# EAGLE schematic Summer Board (EAGLE 9.6.2)
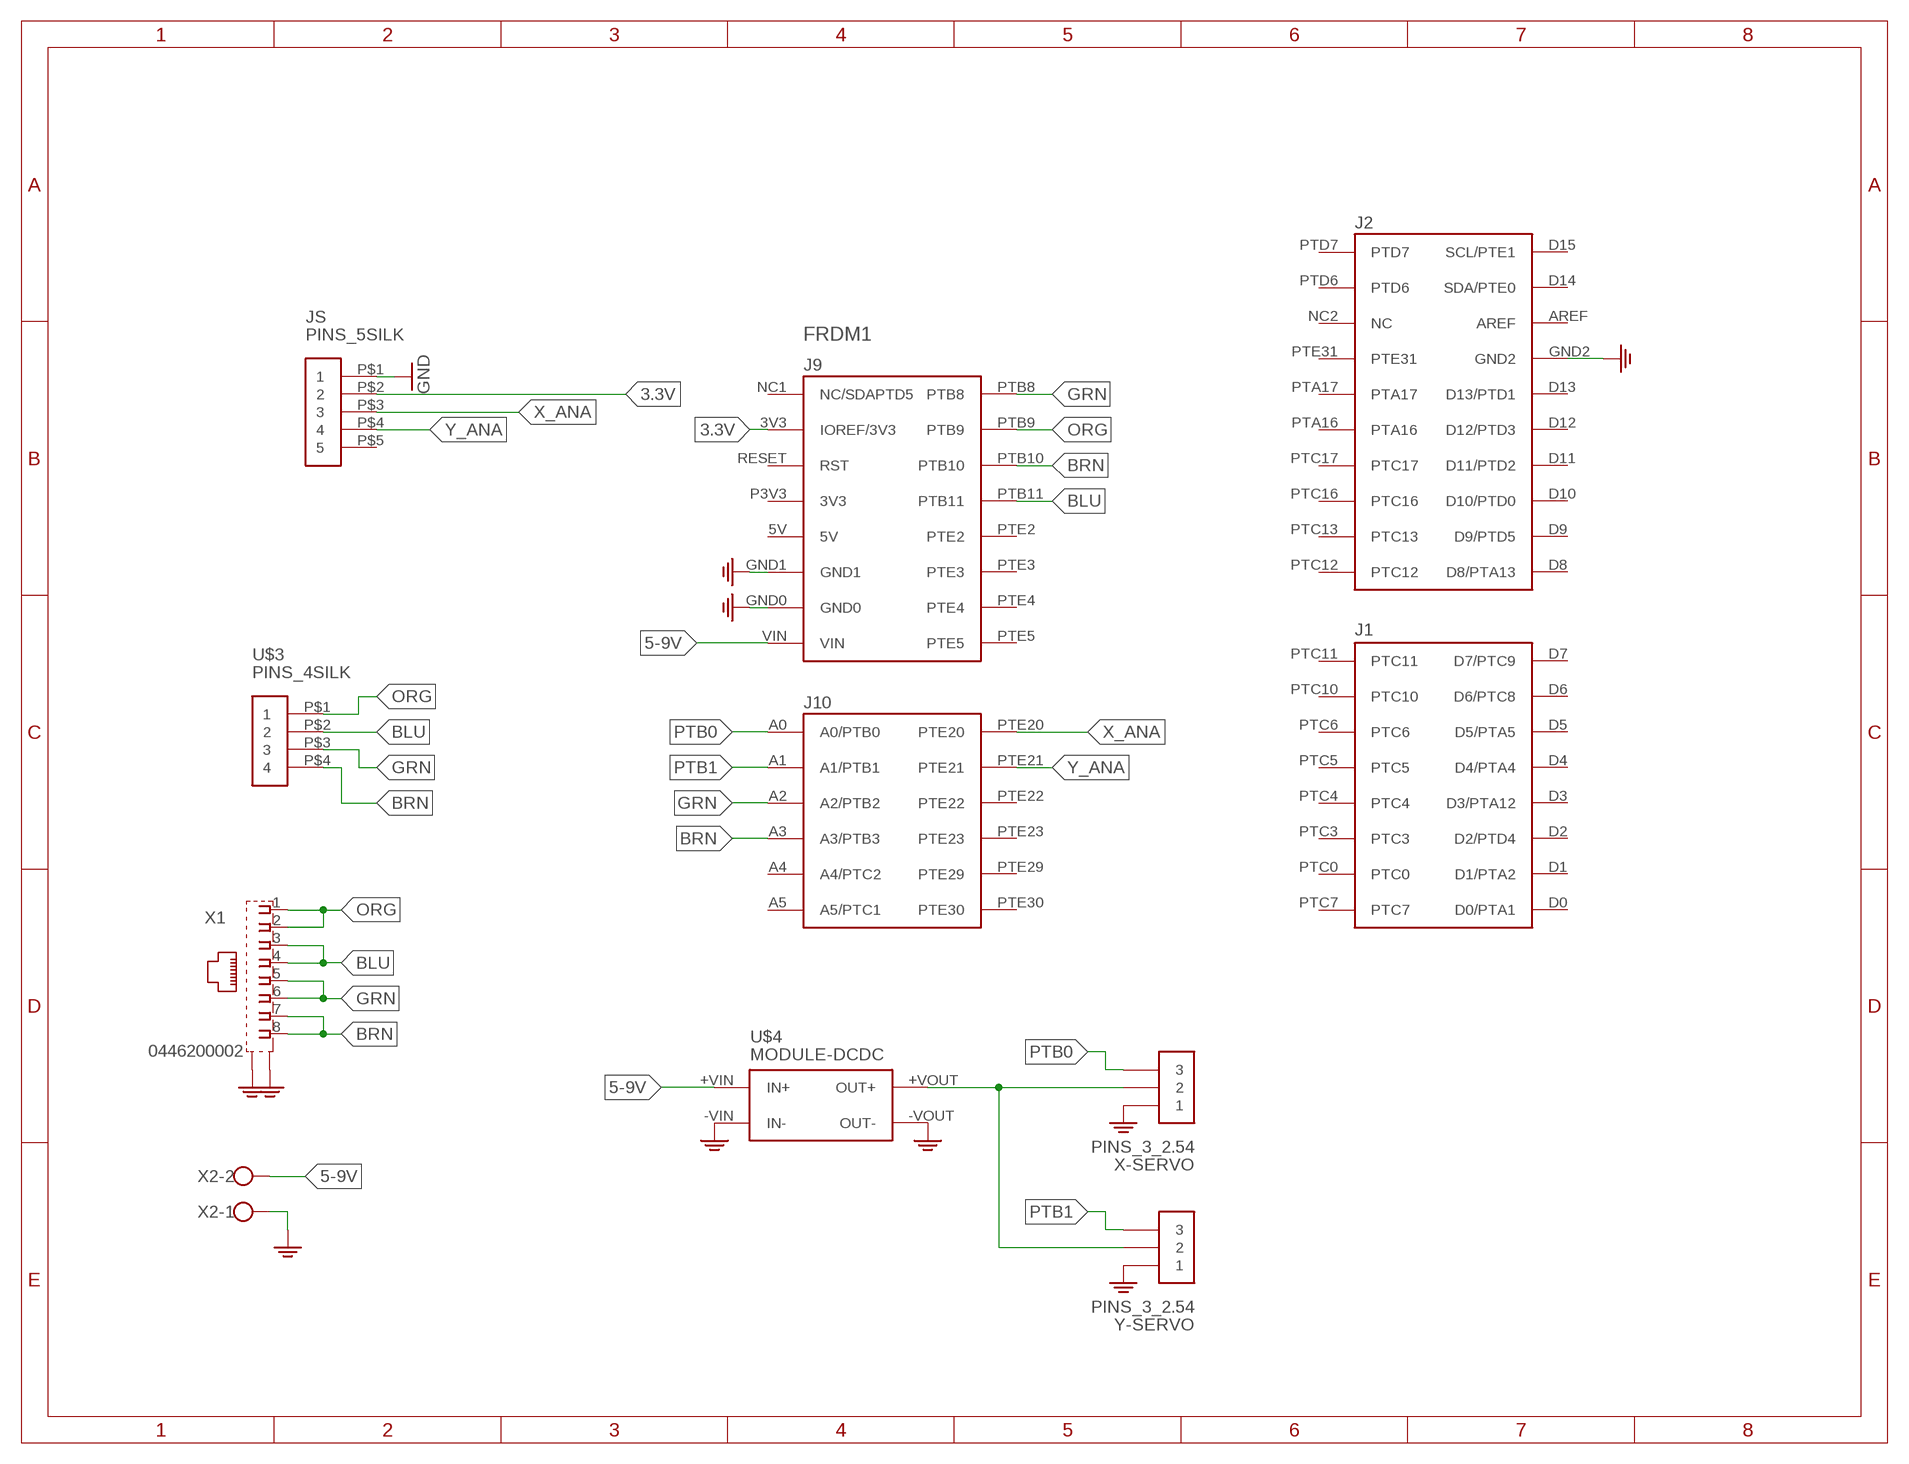
[diagram p0: schematic, sheet 1]

## Parts
FRDM1  FRDM-KL25ZNORMAL  [FRDM_KL25Z_NORMAL]
JS  PINS_5SILK  [PCB_5]
U$3  PINS_4SILK  [PCB_4]
U$4  MODULE-DCDC  [DCDC_CONVERTER_MH]
X1  0446200002  [0446200002]
X2  W237-102  [W237-102]
X-SERVO  PINS_3_2.54  [PINS_3]
Y-SERVO  PINS_3_2.54  [PINS_3]

## Nets
3.3V: FRDM1.3V3(IOREF/3V3) JS.P$2
5-9V: FRDM1.VIN U$4.+VIN(IN+) X2.2
BLU: FRDM1.PTB11 U$3.P$2 X1.3 X1.4
BRN: FRDM1.A3(A3/PTB3) FRDM1.PTB10 U$3.P$4 X1.7 X1.8
GND: FRDM1.GND0 FRDM1.GND1 FRDM1.GND2 JS.P$1 U$4.-VIN(IN-) U$4.-VOUT(OUT-) X1.S@1(S1) X1.S@2(S2) X2.1 X-SERVO.1 Y-SERVO.1
GRN: FRDM1.A2(A2/PTB2) FRDM1.PTB8 U$3.P$3 X1.5 X1.6
N$2: U$4.+VOUT(OUT+) X-SERVO.2 Y-SERVO.2
ORG: FRDM1.PTB9 U$3.P$1 X1.1 X1.2
PTB0: FRDM1.A0(A0/PTB0) X-SERVO.3
PTB1: FRDM1.A1(A1/PTB1) Y-SERVO.3
X_ANA: FRDM1.PTE20 JS.P$3
Y_ANA: FRDM1.PTE21 JS.P$4
Unconnected: FRDM1.5V FRDM1.A4(A4/PTC2) FRDM1.A5(A5/PTC1) FRDM1.AREF FRDM1.D0(D0/PTA1) FRDM1.D1(D1/PTA2) FRDM1.D2(D2/PTD4) FRDM1.D3(D3/PTA12) FRDM1.D4(D4/PTA4) FRDM1.D5(D5/PTA5) FRDM1.D6(D6/PTC8) FRDM1.D7(D7/PTC9) FRDM1.D8(D8/PTA13) FRDM1.D9(D9/PTD5) FRDM1.D10(D10/PTD0) FRDM1.D11(D11/PTD2) FRDM1.D12(D12/PTD3) FRDM1.D13(D13/PTD1) FRDM1.D14(SDA/PTE0) FRDM1.D15(SCL/PTE1) FRDM1.NC1(NC/SDAPTD5) FRDM1.NC2(NC) FRDM1.P3V3(3V3) FRDM1.PTA16 FRDM1.PTA17 FRDM1.PTC0 FRDM1.PTC3 FRDM1.PTC4 FRDM1.PTC5 FRDM1.PTC6 FRDM1.PTC7 FRDM1.PTC10 FRDM1.PTC11 FRDM1.PTC12 FRDM1.PTC13 FRDM1.PTC16 FRDM1.PTC17 FRDM1.PTD6 FRDM1.PTD7 FRDM1.PTE2 FRDM1.PTE3 FRDM1.PTE4 FRDM1.PTE5 FRDM1.PTE22 FRDM1.PTE23 FRDM1.PTE29 FRDM1.PTE30 FRDM1.PTE31 FRDM1.RESET(RST) JS.P$5

## Library data of the parts
FRDM1 = nolan-utsa:FRDM-KL25Z: For creating FRDM-KL25Z shields
JS = nolan-utsa:PINS_5
U$3 = nolan-utsa:PINS_4
U$4 = nolan-utsa:MODULE-DCDC
X1 = con-molex:0446200002: RJ-45 INVERTED MODULAR JACK ASSEMBLY WITH RJ-11 KEEPOUT FEATURE Source: Data sheet <http://www.farnell.com/datasheets/73207.pdf> MOLEX 0446200002 BUCHSE, RJ45, GESCHIRMT Source: Farnell <http://de.farnell.com/molex/0446200002/buchse-rj45-geschirmt/dp/9251910?ost=9251910>; MF: MOLEX; MPN: 0446200002; OC_FARNELL: 9251910
X2 = con-wago-500:W237-102: WAGO SCREW CLAMP; MPN: 237-102; OC_FARNELL: unknown; OC_NEWARK: 70K9898
X-SERVO Y-SERVO = nolan-utsa:PINS_3